# Altium project board-rf-4kenh.PrjPcb
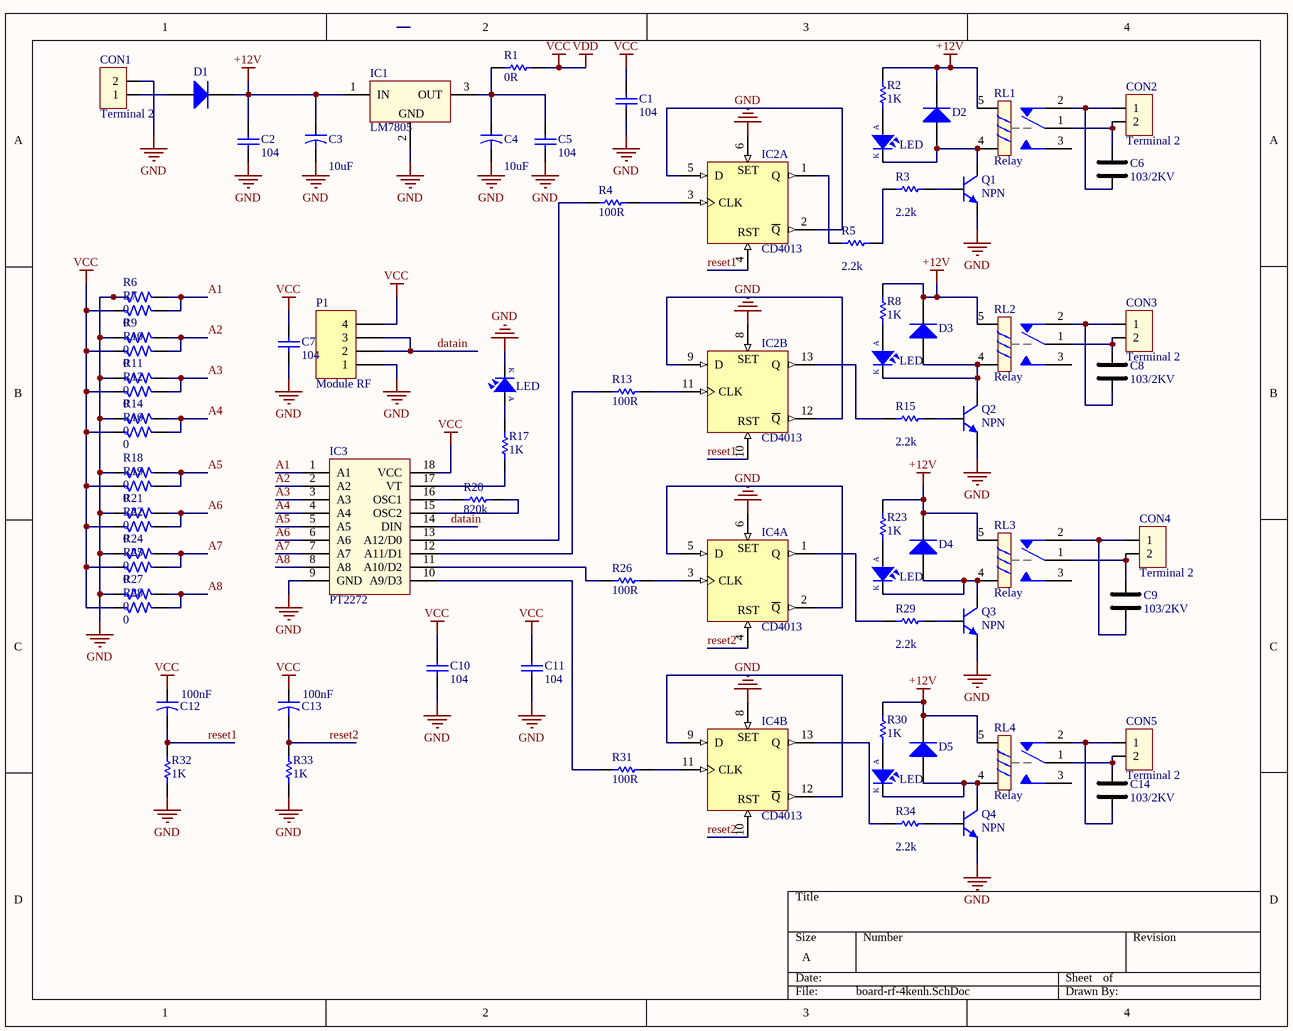
[diagram p0: board-rf-4kenh.SchDoc]
1 sheet, 76 parts. Net scope: global (net labels, ports and power ports of the same name join across sheets).
Board file: board-rf-4kenh.PcbDoc

## Sheet board-rf-4kenh.SchDoc
size A

### Parts
C1  value 104  [C_Ceramic]  (hidden comment: Cap1)
C2  value 104  [C_Ceramic]  (hidden comment: Cap1)
C3  value 10uF  [CAPACITOR 6.3x11]  (hidden comment: Cap2)
C4  value 10uF  [CAPACITOR 6.3x11]  (hidden comment: Cap2)
C5  value 104  [C_Ceramic]  (hidden comment: Cap1)
C6  103/2KV  [103/2KV]
C7  value 104  [C_Ceramic]  (hidden comment: Cap1)
C8  103/2KV  [103/2KV]
C9  103/2KV  [103/2KV]
C10  value 104  [C_Ceramic]  (hidden comment: Cap1)
C11  value 104  [CM 0805]  (hidden comment: Cap1)
C12  value 100nF  [CM-0805]  (hidden comment: Cap2)
C13  value 100nF  [CM-0805]  (hidden comment: Cap2)
C14  103/2KV  [103/2KV]
CON1  Terminal 2  [Terminal 2 5.08]
CON2  Terminal 2  [Terminal 2 5.08]
CON3  Terminal 2  [Terminal 2 5.08]
CON4  Terminal 2  [Terminal 2 5.08]
CON5  Terminal 2  [Terminal 2 5.08]
D1  Diode 1N4007  [DO-41]  (value not drawn)
D2  Diode 1N4148  [DO-41]  (value not drawn)
D3  Diode 1N4148  [DO-41]  (value not drawn)
D4  Diode 1N4148  [DO-41]  (value not drawn)
D5  Diode 1N4148  [DO-41]  (value not drawn)
IC1  LM7805  [TO220]
IC2  CD4013  [DIP14/W0.3]  (parts A,B of 2)
IC3  PT2272  [DIP.100/18/W.300/L.900]
IC4  CD4013  [DIP14/W0.3]  (parts A,B of 2)
LED1  LED  [LED-5R]
LED2  LED  [LED-5R]
LED3  LED  [LED-5R]
LED4  LED  [LED-5R]
LED5  LED  [LED-5R]
P1  Module RF  [HDR1X4]
Q1  NPN  [TRAN-LOWPOWER]
Q2  NPN  [TRAN-LOWPOWER]
Q3  NPN  [TRAN-LOWPOWER]
Q4  NPN  [TRAN-LOWPOWER]
R1  value 0R  [R0.25W-D7.6]  (hidden comment: Res1)
R2  value 1K  [R 1/4W1]  (hidden comment: Res1)
R3  value 2.2k  [R0.25W-D7.6]  (hidden comment: Res1)
R4  value 100R  [R0.25W-D7.6]  (hidden comment: Res1)
R5  value 2.2k  [R0.25W-D7.6]  (hidden comment: Res1)
R6  0  [R 0805]
R7  0  [R 0805]
R8  value 1K  [R 1/4W1]  (hidden comment: Res1)
R9  0  [R 0805]
R10  0  [R 0805]
R11  0  [R 0805]
R12  0  [R 0805]
R13  value 100R  [R0.25W-D7.6]  (hidden comment: Res1)
R14  0  [R 0805]
R15  value 2.2k  [R0.25W-D7.6]  (hidden comment: Res1)
R16  0  [R 0805]
R17  value 1K  [R0.25W-D7.6]  (hidden comment: Res1)
R18  0  [R 0805]
R19  0  [R 0805]
R20  value 820k  [R0805]  (hidden comment: Res1)
R21  0  [R 0805]
R22  0  [R 0805]
R23  value 1K  [R 1/4W1]  (hidden comment: Res1)
R24  0  [R 0805]
R25  0  [R 0805]
R26  value 100R  [R0.25W-D7.6]  (hidden comment: Res1)
R27  0  [R 0805]
R28  0  [R 0805]
R29  value 2.2k  [R0.25W-D7.6]  (hidden comment: Res1)
R30  value 1K  [R 1/4W1]  (hidden comment: Res1)
R31  value 100R  [R0.25W-D7.6]  (hidden comment: Res1)
R32  value 1K  [R0805]  (hidden comment: Res1)
R33  value 1K  [R0805]  (hidden comment: Res1)
R34  value 2.2k  [R0.25W-D7.6]  (hidden comment: Res1)
RL1  Relay  [RELAY5PIN-10A]
RL2  Relay  [RELAY5PIN-10A]
RL3  Relay  [RELAY5PIN-10A]
RL4  Relay  [RELAY5PIN-10A]

### Nets
+12V: C2.2 C3.1 D1.2(K) D2.2(K) D3.2(K) D4.2(K) D5.2(K) IC1.1(IN) R2.2 R8.2 R23.2 R30.2 RL1.5 RL2.5 RL3.5 RL4.5
GND: C1.1 C2.1 C3.2 C4.2 C5.1 C7.1 C10.1 C11.1 CON1.2 IC1.2(GND) IC2.6(S) IC2.7(GND) IC2.8(S) IC3.9(GND) IC4.6(S) IC4.7(GND) IC4.8(S) LED3.2(K) P1.1 Q1.1(E) Q2.1(E) Q3.1(E) Q4.1(E) R6.1 R9.1 R11.1 R14.1 R18.1 R21.1 R24.1 R27.1 R32.2 R33.2
VCC: C1.2 C7.2 C10.2 C11.2 C12.1 C13.1 IC2.14(VDD) IC3.18(VCC) IC4.14(VDD) P1.4 R1.1 R7.1 R10.1 R12.1 R16.1 R19.1 R22.1 R25.1 R28.1  [also labelled VDD]
A1: IC3.1(A1) R6.2 R7.2
A2: IC3.2(A2) R9.2 R10.2
A3: IC3.3(A3) R11.2 R12.2
A4: IC3.4(A4) R14.2 R16.2
A5: IC3.5(A5) R18.2 R19.2
A6: IC3.6(A6) R21.2 R22.2
A7: IC3.7(A7) R24.2 R25.2
A8: IC3.8(A8) R27.2 R28.2
datain: IC3.14(DIN) P1.2 P1.3
reset1: C12.2 IC2.4(RST) IC2.10(RST) R32.1
reset2: C13.2 IC4.4(RST) IC4.10(RST) R33.1
NetC4_1: C4.1 C5.2 IC1.3(OUT) R1.2
NetC6_1: C6.1 CON2.1 RL1.2
NetC6_2: C6.2 CON2.2 RL1.1
NetC8_1: C8.1 CON3.1 RL2.2
NetC8_2: C8.2 CON3.2 RL2.1
NetC9_1: C9.1 CON4.1 RL3.2
NetC9_2: C9.2 CON4.2 RL3.1
NetC14_1: C14.1 CON5.1 RL4.2
NetC14_2: C14.2 CON5.2 RL4.1
NetCON1_1: CON1.1 D1.1(A)
NetD2_1: D2.1(A) LED1.2(K) Q1.2(C) RL1.4
NetD3_1: D3.1(A) LED2.2(K) Q2.2(C) RL2.4
NetD4_1: D4.1(A) LED4.2(K) Q3.2(C) RL3.4
NetD5_1: D5.1(A) LED5.2(K) Q4.2(C) RL4.4
NetIC2_1: IC2.1(Q) R5.1
NetIC2_2: IC2.2(~{Q}) IC2.5(D)
NetIC2_3: IC2.3(CLK) R4.1
NetIC2_9: IC2.9(D) IC2.12(~{Q})
NetIC2_11: IC2.11(CLK) R13.1
NetIC2_13: IC2.13(Q) R15.1
NetIC3_10: IC3.10(A9/D3) R31.2
NetIC3_11: IC3.11(A10/D2) R26.2
NetIC3_12: IC3.12(A11/D1) R13.2
NetIC3_13: IC3.13(A12/D0) R4.2
NetIC3_15: IC3.15(OSC2) R20.1
NetIC3_16: IC3.16(OSC1) R20.2
NetIC3_17: IC3.17(VT) R17.2
NetIC4_1: IC4.1(Q) R29.1
NetIC4_2: IC4.2(~{Q}) IC4.5(D)
NetIC4_3: IC4.3(CLK) R26.1
NetIC4_9: IC4.9(D) IC4.12(~{Q})
NetIC4_11: IC4.11(CLK) R31.1
NetIC4_13: IC4.13(Q) R34.1
NetLED1_1: LED1.1(A) R2.1
NetLED2_1: LED2.1(A) R8.1
NetLED3_1: LED3.1(A) R17.1
NetLED4_1: LED4.1(A) R23.1
NetLED5_1: LED5.1(A) R30.1
NetQ1_3: Q1.3(B) R3.2
NetQ2_3: Q2.3(B) R15.2
NetQ3_3: Q3.3(B) R29.2
NetQ4_3: Q4.3(B) R34.2
NetR3_1: R3.1 R5.2

Not connected (* = marked no-connect by the designer): RL1 3; RL2 3; RL3 3; RL4 3

### Notes on the sheet
- (in symbol CD4013B, part A) SET
- (in symbol CD4013B, part B) SET

### Library data of the parts
C1 C2 C5 C7 C10 C11 = Cap1: Polar Capacitor; Published: 8-Jun-2000; LatestRevisionDate: 17-Jul-2002; LatestRevisionNote: Re-released for DXP Platform.; PackageReference: RAD-0.3; Publisher: Altium Limited; PackageDescription: Radial Cap, Thru-Hole; 2 Leads; 0.3 in Pin Spacing
C3 C4 C12 C13 = Cap2: Capacitor; Published: 23-Sep-2002; PackageReference: CAPR5-4X5; Publisher: Altium Limited; PackageDescription: Capacitor; 2 Leads
CON1-CON5 = Terminal 2: Value: Connector 2
D1 = Diode 1N4007: 1 Amp General Purpose Rectifier; Published: 8-Jun-2000; LatestRevisionDate: 17-Jul-2002; LatestRevisionNote: Re-released for DXP Platform.; DatasheetVersion: 1998; PackageVersion: Aug-1999; PackageReference: DO-41; Publisher: Altium Limited; PackageDescription: Diode, Axial; Body 5.2 x 2.7 mm (LxDia. max), Lead Dia. 0.86 mm (max); Code_JEDEC: DO-204-AL; ComponentLink1Description: Manufacturer Link; ComponentLink1URL: http://www.fairchildsemi.com/; ComponentLink2Description: Datasheet; ComponentLink2URL: http://www.fairchildsemi.com/ds/1N%2F1N4001.pdf
D2-D5 = Diode 1N4148: High Conductance Fast Diode; Published: 8-Jun-2000; LatestRevisionDate: 17-Jul-2002; LatestRevisionNote: Re-released for DXP Platform.; DatasheetVersion: 1997; PackageReference: DO-35; Publisher: Altium Limited; PackageDescription: Diode, Axial; Body 3.8 x 1.9 mm (LxDia. max), Lead Dia. 0.53 mm (max); Code_JEDEC: DO-204-AH; ComponentLink1Description: Manufacturer Link; ComponentLink1URL: http://www.fairchildsemi.com/; ComponentLink2Description: Datasheet; ComponentLink2URL: http://www.fairchildsemi.com/ds/1N%2F1N4148.pdf
IC1 = LM78xx: On ap +, from + 5 to + 24VDC; Value: LM7805
IC2 IC4 = CD4013B: Dual D-Type Flip-Flop; Creat by: VanDungEvn@Gmail.com
IC3 = PT2272: Remote Control Decoder
LED1-LED5 = LED: LED Single colour Green and Red; Value: LED 3 ly Single Colour
P1 = Header 4: Header, 4-Pin; LatestRevisionDate: 17-Jul-2002; LatestRevisionNote: Re-released for DXP Platform.; Publisher: Altium Limited
Q1-Q4 = NPN: NPN General; Published: 8-Jun-2000; LatestRevisionDate: 15-Jan-2003; LatestRevisionNote: PCB Footprint 'BCY-W3/D4.7' replaced; DatasheetDocument: 1997; PackageDocument: Sep-1998; PackageReference: TO-92A; Publisher: Altium Limited; Code_JEDEC: TO-92A; ComponentLink1Description: Manufacturer Link; ComponentLink1URL: http://www.fairchildsemi.com/; ComponentLink2Description: Datasheet; ComponentLink2URL: http://www.fairchildsemi.com/ds/2N%2F2N3904.pdf
R1-R5 R8 R13 R15 R17 R20 R23 R26 R29-R34 = Res1: Resistor; Published: 8-Jun-2000; LatestRevisionDate: 17-Jul-2002; LatestRevisionNote: Re-released for DXP Platform.; PackageReference: AXIAL-0.3; Publisher: Altium Limited; PackageDescription: Axial Device, Thru-Hole; 2 Leads; 0.3 in Pin Spacing
R6 R7 R9-R12 R14 R16 R18 R19 R21 R22 R24 R25 R27 R28 = RM: Resistor SMD; Manufacturer No: RM10JTN102; Manufacturer: UniOhm; Value: 1k; Power Rating: 1/10W; Specification: ="Value" + "  "+ "Power Rating"
RL1-RL4 = Relay 1: Relay SPDT 5 Pin; Value: Relay SPDT, 10A, 12V